# Altium schematic sheet FPGA-7.SchDoc
size A3; Date: Date; CompanyName: HESSO; Engineer: Name; Address1: Route du Rawyl 47; Address2: 1950 Sion; Address3: Switzerland; ProjectName: Project Name
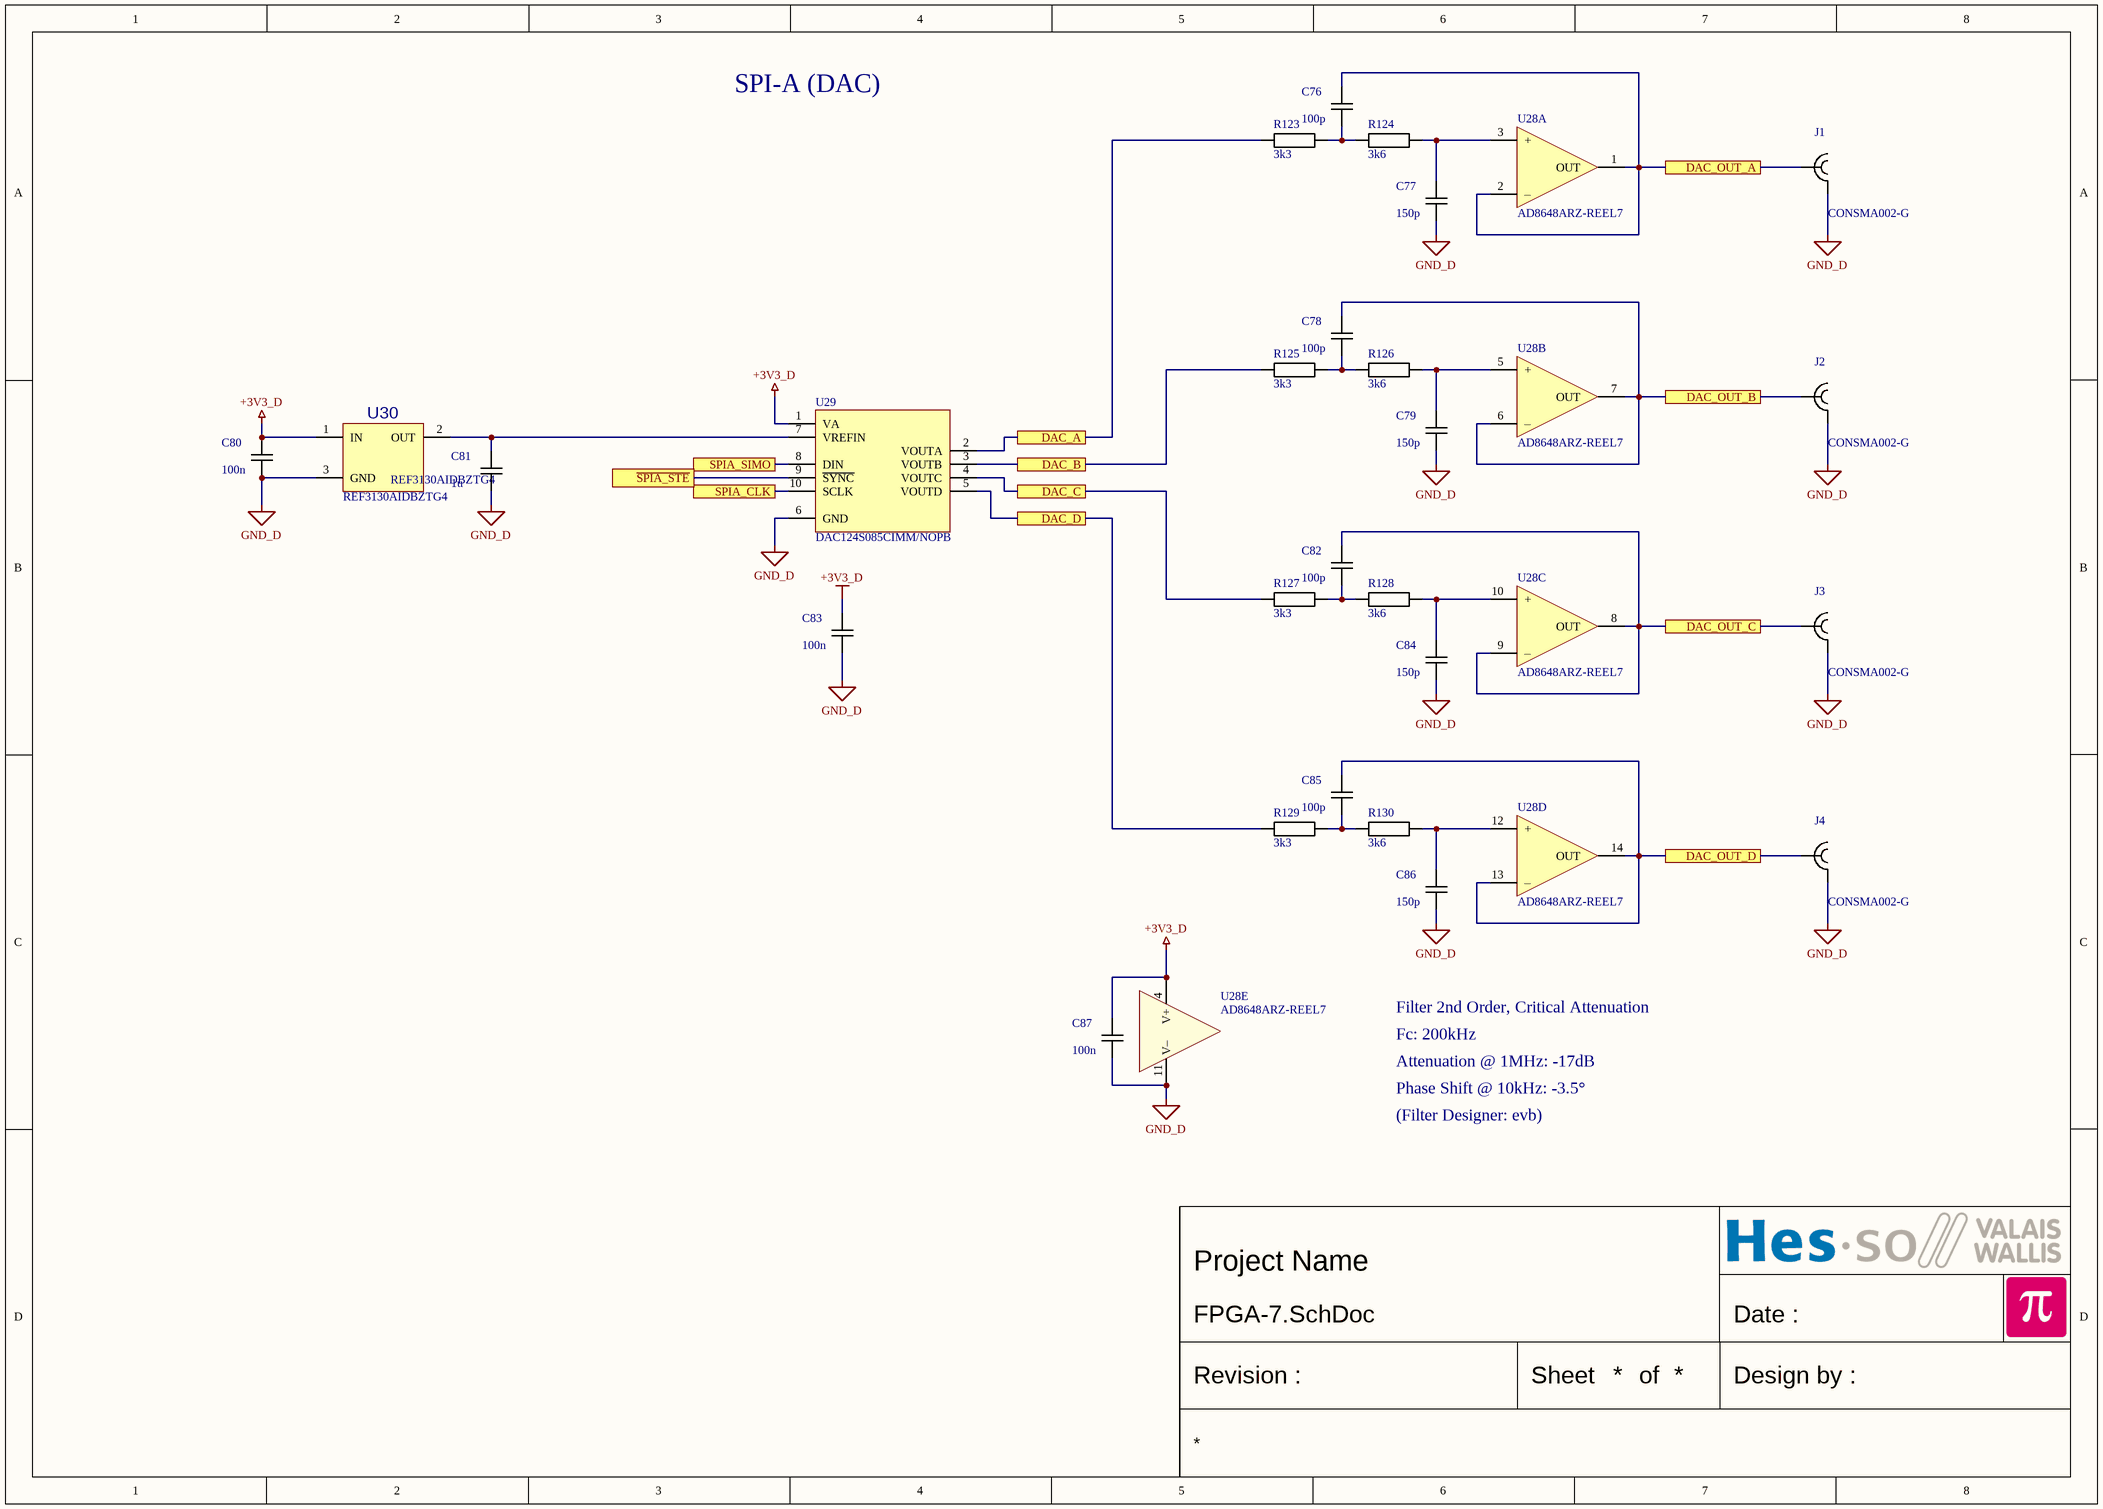
[diagram p0: FPGA-7.SchDoc]

## Parts
C76  100p  [CAPACITOR 2012 REFLOW]
C77  150p  [CAPACITOR 2012 REFLOW]
C78  100p  [CAPACITOR 2012 REFLOW]
C79  150p  [CAPACITOR 2012 REFLOW]
C80  100n  [CAPACITOR 2012 REFLOW]
C81  1u  [CAPACITOR 2012 REFLOW]
C82  100p  [CAPACITOR 2012 REFLOW]
C83  100n  [CAPACITOR 1608 REFLOW]
C84  150p  [CAPACITOR 2012 REFLOW]
C85  100p  [CAPACITOR 2012 REFLOW]
C86  150p  [CAPACITOR 2012 REFLOW]
C87  100n  [CAPACITOR 1608 REFLOW]
J1  CONSMA002-G  [SMA TH Right Angle Linx CONSMA002]
J2  CONSMA002-G  [SMA TH Right Angle Linx CONSMA002]
J3  CONSMA002-G  [SMA TH Right Angle Linx CONSMA002]
J4  CONSMA002-G  [SMA TH Right Angle Linx CONSMA002]
R123  3k3  [RESISTOR 2012 REFLOW]
R124  3k6  [RESISTOR 2012 REFLOW]
R125  3k3  [RESISTOR 2012 REFLOW]
R126  3k6  [RESISTOR 2012 REFLOW]
R127  3k3  [RESISTOR 2012 REFLOW]
R128  3k6  [RESISTOR 2012 REFLOW]
R129  3k3  [RESISTOR 2012 REFLOW]
R130  3k6  [RESISTOR 2012 REFLOW]
U28  AD8648ARZ-REEL7  [SO14 P1.27 C4.0X8.8 H1.75]  (parts A,B,C,D,E of 5)
U29  DAC124S085CIMM/NOPB  [VSSOP10 P0.5 C3.1X3.1 H1.1]
U30  REF3130AIDBZTG4  [SOT23 P0.95 C1.6x3.0 H1.3]

## Ports
DAC_A, DAC_B, DAC_C, DAC_D, DAC_OUT_A, DAC_OUT_B, DAC_OUT_C, DAC_OUT_D, SPIA_CLK, SPIA_SIMO, ~{SPIA_STE}

## Nets
+3V3_D: C80.2 C83.2 C87.2 U28.4(V+) U29.1(VA) U30.1(IN)
GND_D: C77.1 C79.1 C80.1 C81.1 C83.1 C84.1 C86.1 C87.1 J1.2 J2.2 J3.2 J4.2 U28.11(V–) U29.6(GND) U30.3(GND)
~{SPIA_STE}: U29.9(~{SYNC}) ; port ~{SPIA_STE}
DAC_A: R123.1 U29.2(VOUTA) ; port DAC_A
DAC_B: R125.1 U29.3(VOUTB) ; port DAC_B
DAC_C: R127.1 U29.4(VOUTC) ; port DAC_C
DAC_D: R129.1 U29.5(VOUTD) ; port DAC_D
DAC_OUT_A: C76.2 J1.1 U28.1(OUT) U28.2(–) ; port DAC_OUT_A
DAC_OUT_B: C78.2 J2.1 U28.6(–) U28.7(OUT) ; port DAC_OUT_B
DAC_OUT_C: C82.2 J3.1 U28.8(OUT) U28.9(–) ; port DAC_OUT_C
DAC_OUT_D: C85.2 J4.1 U28.13(–) U28.14(OUT) ; port DAC_OUT_D
SPIA_CLK: U29.10(SCLK) ; port SPIA_CLK
SPIA_SIMO: U29.8(DIN) ; port SPIA_SIMO
NetC76_1: C76.1 R123.2 R124.1
NetC77_2: C77.2 R124.2 U28.3(+)
NetC78_1: C78.1 R125.2 R126.1
NetC79_2: C79.2 R126.2 U28.5(+)
NetC81_2: C81.2 U29.7(VREFIN) U30.2(OUT)
NetC82_1: C82.1 R127.2 R128.1
NetC84_2: C84.2 R128.2 U28.10(+)
NetC85_1: C85.1 R129.2 R130.1
NetC86_2: C86.2 R130.2 U28.12(+)

## Notes on the sheet
- SPI-A (DAC)
- Filter 2nd Order, Critical Attenuation
- Fc: 200kHz
- Attenuation @ 1MHz: -17dB
- Phase Shift @ 10kHz: -3.5°
- (Filter Designer: evb)
- Date :
- Revision :
- Sheet
- of
- Design by :

## Library data of the parts
C76-C80 C82 C84-C86 = Capacitor: Capacitor X7R 10% 50V 2012(0805)
  C76 C78 C82 C85: Value: 100p
  C77 C79 C84 C86: Value: 150p
  C80: Value: 100n
C81 = Capacitor: Capacitor X7R 10% 10V 2012(0805); Value: 1u
C83 C87 = Capacitor: Capacitor X7R 10% 50V 1608(0603); Value: 100n
J1-J4 = SMA TH RIGHT ANGLE LINX CONSMA002: Manufacturer: Linx Technologies; Value: CONSMA002-G; Mouser No.: 712-CONSMA002-G
R123-R130 = Resistor: Resistor 1% 50V 125mW 2012(0805)
  R123 R125 R127 R129: Value: 3k3
  R124 R126 R128 R130: Value: 3k6
U28 = OPA QUAD: Generic quad OPA 14 pins; Manufacturer: Analog Devices; Value: AD8648ARZ-REEL7; Mouser No.: 584-AD8648ARZ-R7
U29 = DAC124S085CIMM: DAC124S085 12-Bit Micro Power Quad Digital-to-Analog Converter With Rail-to-Rail Output; Manufacturer: Texas Instruments; Value: DAC124S085CIMM/NOPB; Mouser No.: 926-DAC124S085CIMMNO
U30 = REFERENCE SOT23 IN-OUT- GND: Generic Positive Voltage Reference; Manufacturer: Texas Instruments; Value: REF3130AIDBZTG4; Mouser No.: 595-REF3130AIDBZTG4